# Altium project CAN Hub.PrjPcb
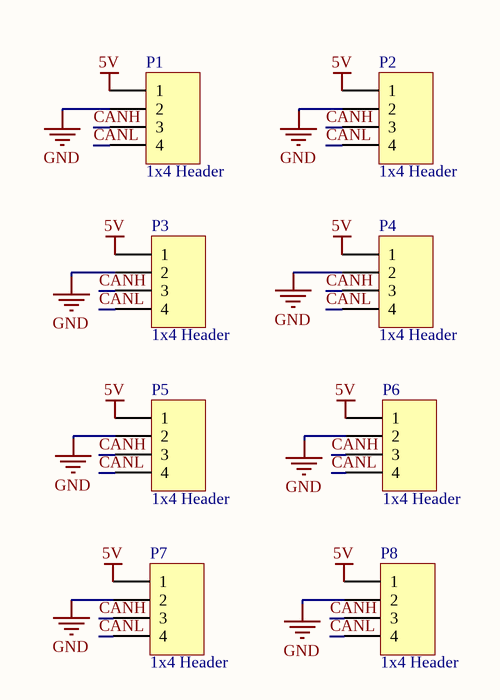
[diagram p0: CAN Hub 1.SchDoc]
1 sheet, 8 parts. Net scope: global (net labels, ports and power ports of the same name join across sheets).
Board file: CAN Hub1.PcbDoc

## Sheet CAN Hub 1.SchDoc: CAN Hub
size A4; Date: Jan 17th, 2022; ApprovedBy: Ellen Wang; CheckedBy: Ellen Wang; Author: Ellen Wang; CompanyName: Waterloop; DrawnBy: Ellen Wang; Engineer: Ellen Wang; Organization: Waterloop; Address1: 200 University Ave W; Address2: Engineering 5, 1104; Address3: Waterloo, ON; Address4: N2L 3G1; SheetNumber: 1; SheetTotal: 1

### Parts
P1  1x4 Header  [HDR1X4]
P2  1x4 Header  [HDR1X4]
P3  1x4 Header  [HDR1X4]
P4  1x4 Header  [HDR1X4]
P5  1x4 Header  [HDR1X4]
P6  1x4 Header  [HDR1X4]
P7  1x4 Header  [HDR1X4]
P8  1x4 Header  [HDR1X4]

### Nets
5V: P1.1 P2.1 P3.1 P4.1 P5.1 P6.1 P7.1 P8.1
GND: P1.2 P2.2 P3.2 P4.2 P5.2 P6.2 P7.2 P8.2
CANH: P1.3 P2.3 P3.3 P4.3 P5.3 P6.3 P7.3 P8.3
CANL: P1.4 P2.4 P3.4 P4.4 P5.4 P6.4 P7.4 P8.4

### Notes on the sheet
- Title:
- Size:
- Date:
- A4
- Author:
- Revision:
- Sheet
- of
- File:

### Library data of the parts
P1-P8 = 1x4 Header: 1x4 Pin Header